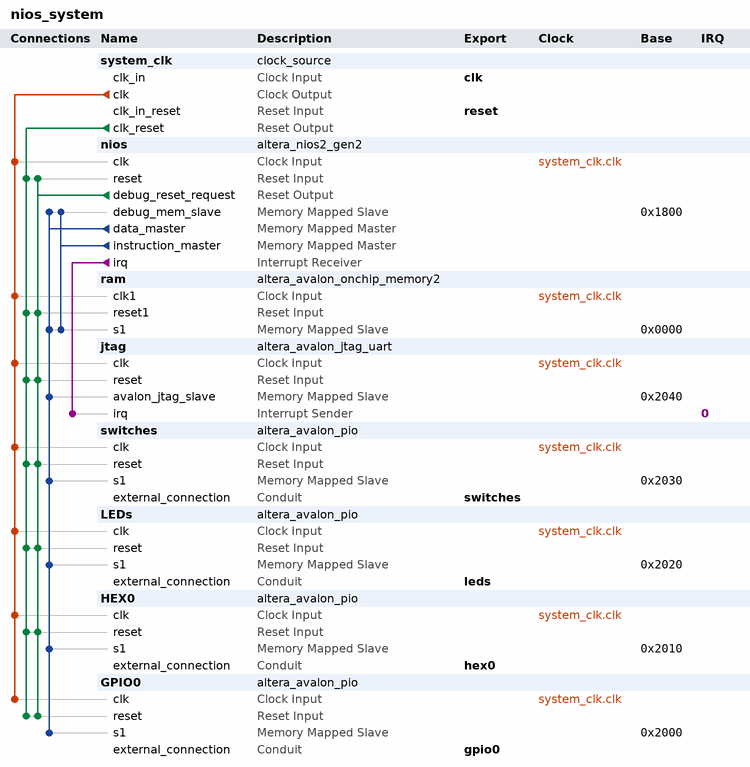
[diagram p0: system contents]
# Platform Designer (Qsys) system nios_system, Cyclone V 5CSEMA5F31C6
# Parameters at their usual value, and those the tool derives, are not listed.
package require -exact qsys 18.1
create_system nios_system
set_project_property DEVICE_FAMILY {Cyclone V}
set_project_property DEVICE 5CSEMA5F31C6

add_instance system_clk clock_source 18.1
set_instance_parameter_value system_clk clockFrequency 50000000

add_instance nios altera_nios2_gen2 18.1
set_instance_parameter_value nios dcache_size 2048
set_instance_parameter_value nios exceptionSlave ram.s1
set_instance_parameter_value nios icache_size 4096
set_instance_parameter_value nios impl Tiny
set_instance_parameter_value nios resetSlave ram.s1

add_instance ram altera_avalon_onchip_memory2 18.1
set_instance_parameter_value ram dataWidth 32
set_instance_parameter_value ram dualPort false
set_instance_parameter_value ram initMemContent true
set_instance_parameter_value ram initializationFileName onchip_mem.hex
set_instance_parameter_value ram memorySize 4096

add_instance jtag altera_avalon_jtag_uart 18.1
set_instance_parameter_value jtag simInteractiveOptions NO_INTERACTIVE_WINDOWS

add_instance switches altera_avalon_pio 18.1
set_instance_parameter_value switches direction Input
set_instance_parameter_value switches width 8

add_instance LEDs altera_avalon_pio 18.1
set_instance_parameter_value LEDs direction Output
set_instance_parameter_value LEDs width 8

add_instance HEX0 altera_avalon_pio 18.1
set_instance_parameter_value HEX0 direction Output
set_instance_parameter_value HEX0 width 8

add_instance GPIO0 altera_avalon_pio 18.1
set_instance_parameter_value GPIO0 direction Output
set_instance_parameter_value GPIO0 width 8

# connections
add_connection system_clk.clk GPIO0.clk clock
add_connection system_clk.clk HEX0.clk clock
add_connection system_clk.clk jtag.clk clock
add_connection system_clk.clk LEDs.clk clock
add_connection system_clk.clk nios.clk clock
add_connection system_clk.clk ram.clk1 clock
add_connection system_clk.clk switches.clk clock
add_connection nios.debug_reset_request GPIO0.reset reset
add_connection nios.debug_reset_request HEX0.reset reset
add_connection nios.debug_reset_request jtag.reset reset
add_connection nios.debug_reset_request LEDs.reset reset
add_connection nios.debug_reset_request nios.reset reset
add_connection nios.debug_reset_request ram.reset1 reset
add_connection nios.debug_reset_request switches.reset reset
add_connection system_clk.clk_reset GPIO0.reset reset
add_connection system_clk.clk_reset HEX0.reset reset
add_connection system_clk.clk_reset jtag.reset reset
add_connection system_clk.clk_reset LEDs.reset reset
add_connection system_clk.clk_reset nios.reset reset
add_connection system_clk.clk_reset ram.reset1 reset
add_connection system_clk.clk_reset switches.reset reset
add_connection nios.data_master GPIO0.s1 avalon
set_connection_parameter_value nios.data_master/GPIO0.s1 baseAddress 0x2000
add_connection nios.data_master HEX0.s1 avalon
set_connection_parameter_value nios.data_master/HEX0.s1 baseAddress 0x2010
add_connection nios.data_master jtag.avalon_jtag_slave avalon
set_connection_parameter_value nios.data_master/jtag.avalon_jtag_slave baseAddress 0x2040
add_connection nios.data_master LEDs.s1 avalon
set_connection_parameter_value nios.data_master/LEDs.s1 baseAddress 0x2020
add_connection nios.data_master nios.debug_mem_slave avalon
set_connection_parameter_value nios.data_master/nios.debug_mem_slave baseAddress 0x1800
add_connection nios.data_master ram.s1 avalon
set_connection_parameter_value nios.data_master/ram.s1 baseAddress 0x0000
add_connection nios.data_master switches.s1 avalon
set_connection_parameter_value nios.data_master/switches.s1 baseAddress 0x2030
add_connection nios.instruction_master nios.debug_mem_slave avalon
set_connection_parameter_value nios.instruction_master/nios.debug_mem_slave baseAddress 0x1800
add_connection nios.instruction_master ram.s1 avalon
set_connection_parameter_value nios.instruction_master/ram.s1 baseAddress 0x0000
add_connection nios.irq jtag.irq interrupt
set_connection_parameter_value nios.irq/jtag.irq irqNumber 0

# exported interfaces
add_interface clk clock sink
set_interface_property clk EXPORT_OF system_clk.clk_in
add_interface gpio0 conduit end
set_interface_property gpio0 EXPORT_OF GPIO0.external_connection
add_interface hex0 conduit end
set_interface_property hex0 EXPORT_OF HEX0.external_connection
add_interface leds conduit end
set_interface_property leds EXPORT_OF LEDs.external_connection
add_interface reset reset sink
set_interface_property reset EXPORT_OF system_clk.clk_in_reset
add_interface switches conduit end
set_interface_property switches EXPORT_OF switches.external_connection

set_interconnect_requirement {$system} qsys_mm.clockCrossingAdapter HANDSHAKE
set_interconnect_requirement {$system} qsys_mm.enableEccProtection FALSE
set_interconnect_requirement {$system} qsys_mm.insertDefaultSlave FALSE
set_interconnect_requirement {$system} qsys_mm.maxAdditionalLatency 1

save_system nios_system.qsys
